# Altium schematic sheet Ethernet.SchDoc
size A3; SheetNumber: 6; SheetTotal: 13
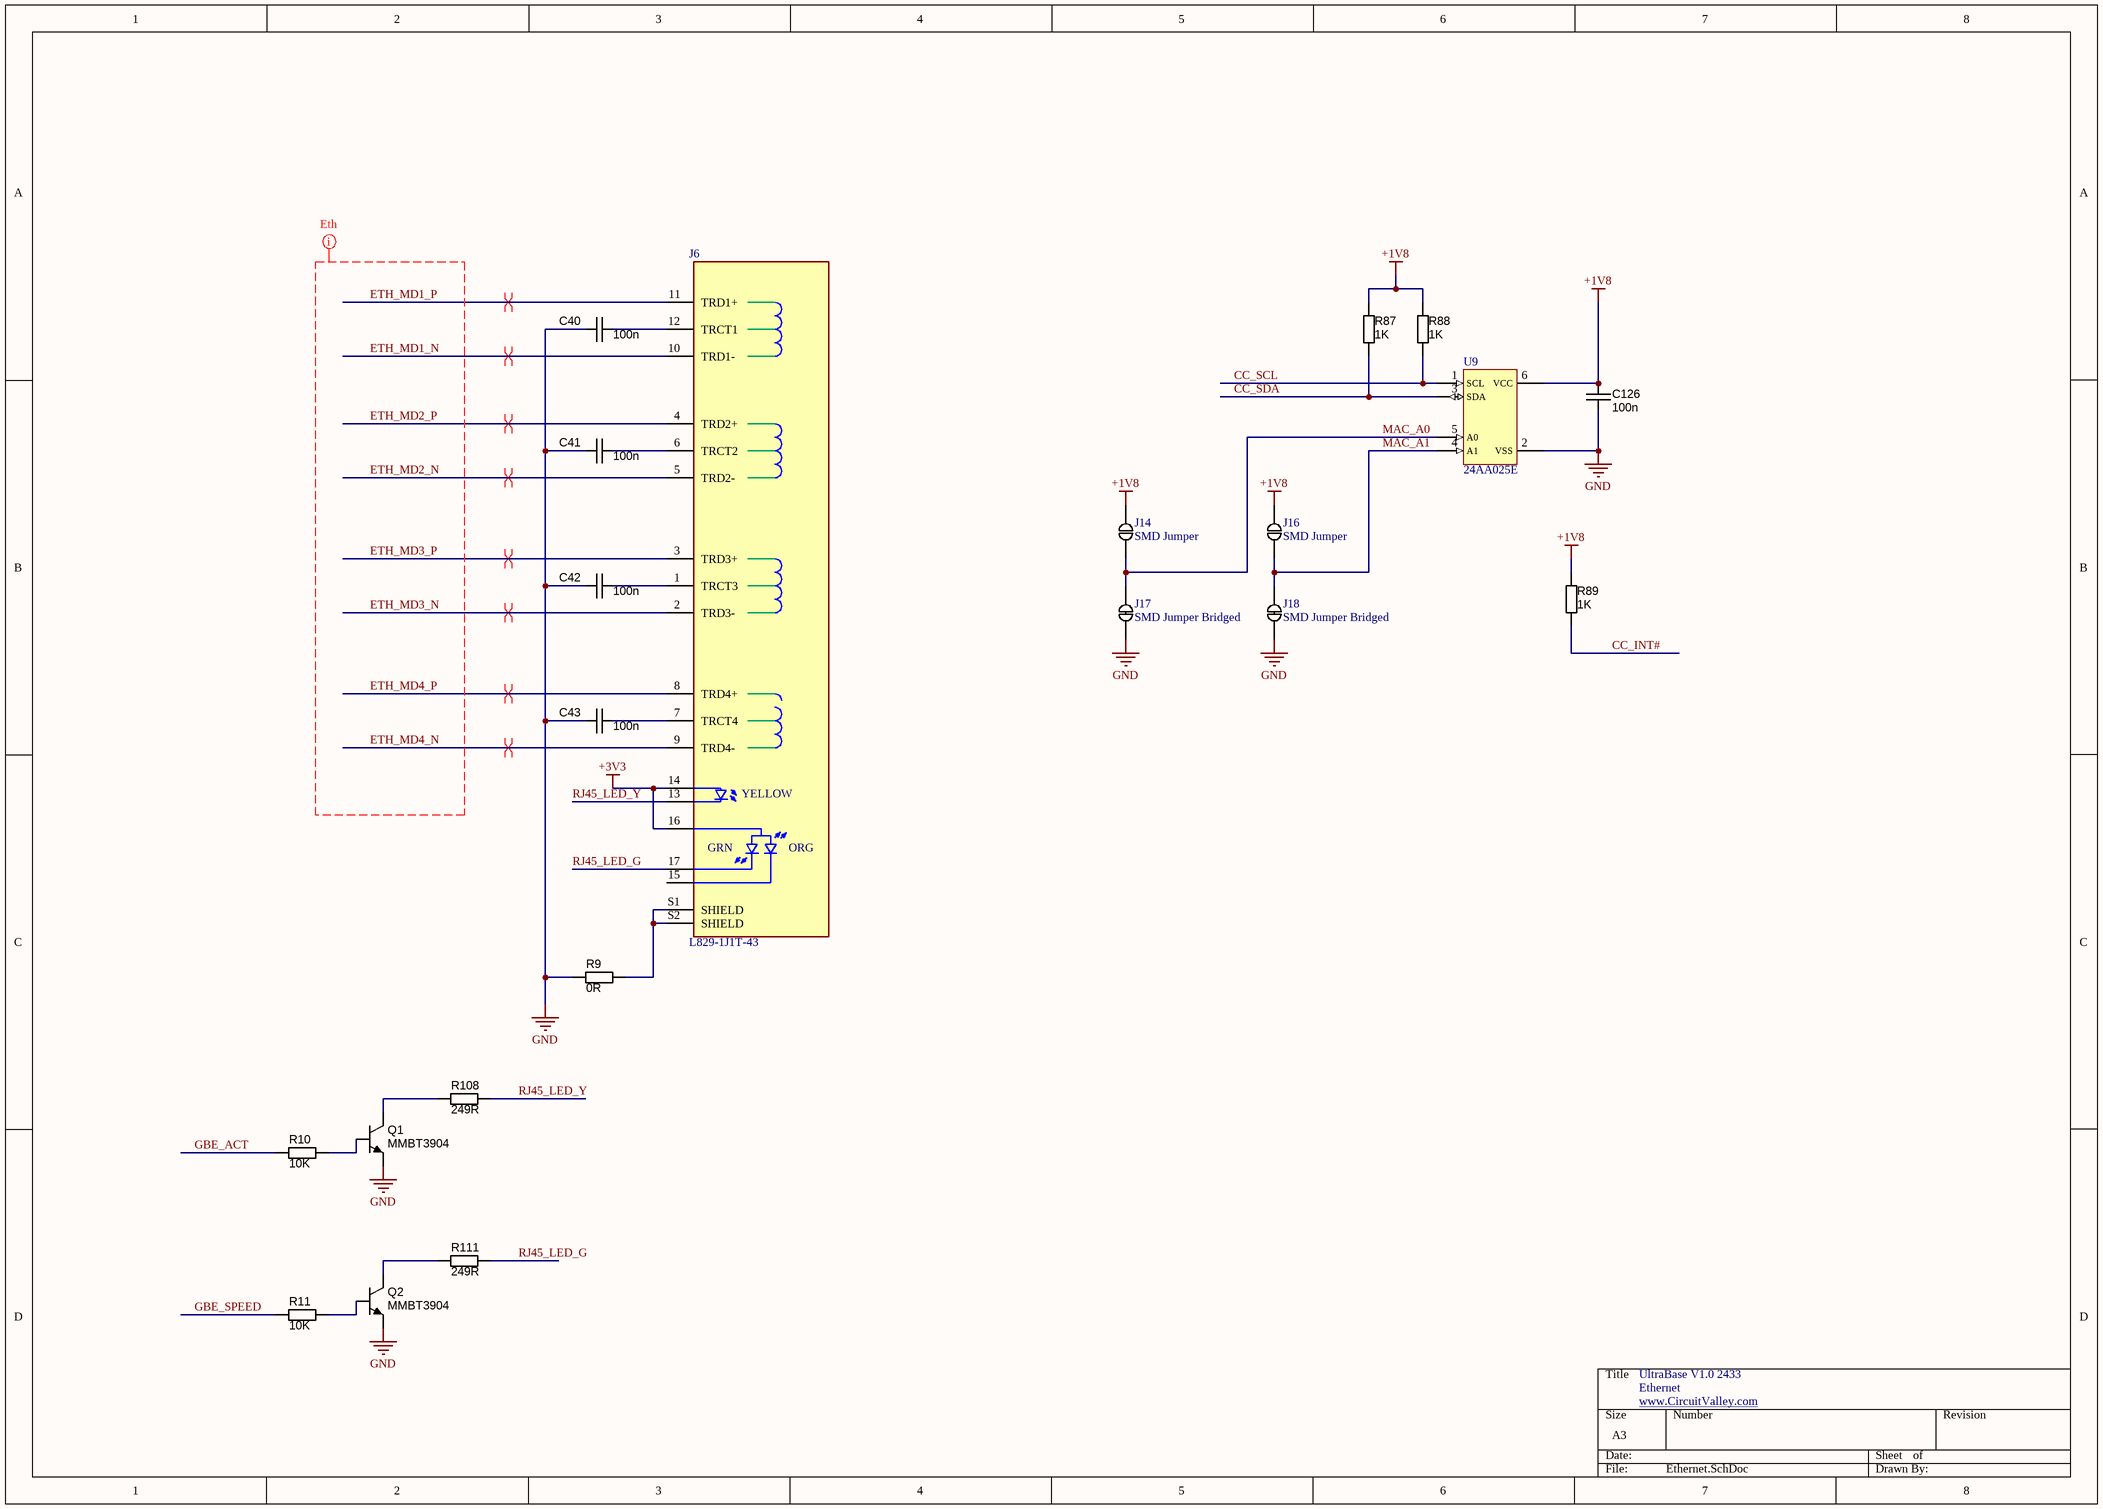
[diagram p0: Ethernet.SchDoc]

## Parts
C40  100n  [CAPC1608N]
C41  100n  [CAPC1608N]
C42  100n  [CAPC1608N]
C43  100n  [CAPC1608N]
C126  100n  [CAPC1608N]
J6  L829-1J1T-43  [L829-1J1T-43]
J14  SMD Jumper  [SMD_Jumper]  (net tie, no BOM)
J16  SMD Jumper  [SMD_Jumper]  (net tie, no BOM)
J17  SMD Jumper Bridged  [SMD_Jumper_bridge]  (net tie, no BOM)
J18  SMD Jumper Bridged  [SMD_Jumper_bridge]  (net tie, no BOM)
Q1  Manufacturer Part Number 1: MMBT3904  [SOT23-3]  (hidden comment: NPN_MMBT3904)
Q2  Manufacturer Part Number 1: MMBT3904  [SOT23-3]  (hidden comment: NPN_MMBT3904)
R9  value 0R  [RESC1608N]  (hidden comment: RES_NL_0603)
R10  value 10K  [RESC1608N]  (hidden comment: RES_NL_0603)
R11  value 10K  [RESC1608N]  (hidden comment: RES_NL_0603)
R87  value 1K  [RESC1608N]  (hidden comment: RES_NL_0603)
R88  value 1K  [RESC1608N]  (hidden comment: RES_NL_0603)
R89  value 1K  [RESC1608N]  (hidden comment: RES_NL_0603)
R108  value 249R  [RESC1608N]  (hidden comment: RES_NL_0603)
R111  value 249R  [RESC1608N]  (hidden comment: RES_NL_0603)
U9  24AA025E  [SOT23-6]

## Nets
+1V8: C126.2 J14.2 J16.2 R87.2 R88.2 R89.2 U9.6(VCC)
+3V3: J6.14(YA_1) J6.16(CA)
GND: C40.1 C41.1 C42.1 C43.1 C126.1 J17.1 J18.1 Q1.2(E) Q2.2(E) R9.1 U9.2(VSS)
CC_INT#: R89.1
CC_SCL: R88.1 U9.1(SCL)
CC_SDA: R87.1 U9.3(SDA)
ETH_MD1_N: J6.10(TRD1-)
ETH_MD1_P: J6.11(TRD1+)
ETH_MD2_N: J6.5(TRD2-)
ETH_MD2_P: J6.4(TRD2+)
ETH_MD3_N: J6.2(TRD3-)
ETH_MD3_P: J6.3(TRD3+)
ETH_MD4_N: J6.9(TRD4-)
ETH_MD4_P: J6.8(TRD4+)
GBE_ACT: R10.1
GBE_SPEED: R11.1
MAC_A0: J14.1 J17.2 U9.5(A0)
MAC_A1: J16.1 J18.2 U9.4(A1)
RJ45_LED_G: J6.17(GK_1) R111.2
RJ45_LED_Y: J6.13(YK_1) R108.2
NetC40_2: C40.2 J6.12(TRCT1)
NetC41_2: C41.2 J6.6(TRCT2)
NetC42_2: C42.2 J6.1(TRCT3)
NetC43_2: C43.2 J6.7(TRCT4)
NetJ6_S1: J6.S1(SHIELD) J6.S2(SHIELD) R9.2
NetQ1_1: Q1.1(B) R10.2
NetQ1_3: Q1.3(C) R108.1
NetQ2_1: Q2.1(B) R11.2
NetQ2_3: Q2.3(C) R111.1

Not connected (* = marked no-connect by the designer): J6 15(OK_1)

## Layout directives
differential pair: ETH_MD1_N, ETH_MD1_P, ETH_MD2_N, ETH_MD2_P, ETH_MD3_N, ETH_MD3_P, ETH_MD4_N, ETH_MD4_P
net class EtherNETETH_MD: ETH_MD1_N, ETH_MD1_P, ETH_MD2_N, ETH_MD2_P, ETH_MD3_N, ETH_MD3_P, ETH_MD4_N, ETH_MD4_P

## Notes on the sheet
- UltraBase V1.0 2433
- Ethernet
- www.CircuitValley.com <http://www.CircuitValley.com>
- (in symbol L829-1J1T-43) YELLOW; GRN; ORG

## Library data of the parts
C40-C43 C126 = CAPC_1n_0603_100V: Capacitor SMD Cer 1nF 10% 100V X7R 0603; Manufacturer 1: Murata Electronics North America; Manufacturer Part Number 1: GCM188R72A102KA37D; Ratings: 100V; X7R; Material: ceramic; Package / Case: 0603 (1608 metric); Tolerance: ±10%; Supplier 1: Digi-Key; Supplier Part Number 1: 490-4780-1-ND; Operating Temperature: -55°C ~ 125°C; Size / Dimension: 0.063" L x 0.031" W (1.60mm x 0.80mm); Thickness (Max): 0.035" (0.90mm); ComponentLink1URL: http://search.murata.co.jp/Ceramy/image/img/PDF/ENG/GCM188R72A102KA37.pdf; ComponentLink1Description: http://search.murata.co.jp/Ceramy/image/img/PDF/ENG/GCM188R72A102KA37.pdf; Value: 100n
J6 = L829-1J1T-43: MagJack 1000BASE-T | 1X1 | 3w-OG/Y | Tab Up | Low Profile | RoHS; MF: Bel Fuse; Value: *; Availability: Unavailable; Package: None; SnapEDA_Link: https://www.snapeda.com/parts/L829-1J1T-43/Bel%20Fuse%20Inc./view-part/562341/?ref=snap; Price: None; MP: L829-1J1T-43
J14 J16 = SMD_Jumper
J17 J18 = SMD_Jumper_Bridged: SMD Jumper
Q1 Q2 = NPN_MMBT3904: Transistor SMD NPN 40V 0.2A 350mW SOT-23; Manufacturer 1: Fairchild Semiconductor; Ratings: 40V; 200mA; 350mW; Material: Si; Package / Case: SOT-23; Supplier 1: Digi-Key; Supplier Part Number 1: MMBT3904FSCT-ND; Transistor Type: NPN; Mounting Type: Surface Mount
R9-R11 R87-R89 R108 R111 = RES_NL_0603: Resistor, SMD chip; Manufacturer 1: Royal Ohm; Ratings: 1/10 W; Tolerance: ±5%; Package / Case: 0603 (1608 metric)
U9 = 24AA025E: MAC EEPROM